# EAGLE board RX08-8-9 (EAGLE 6.6.0), part 1 of 2
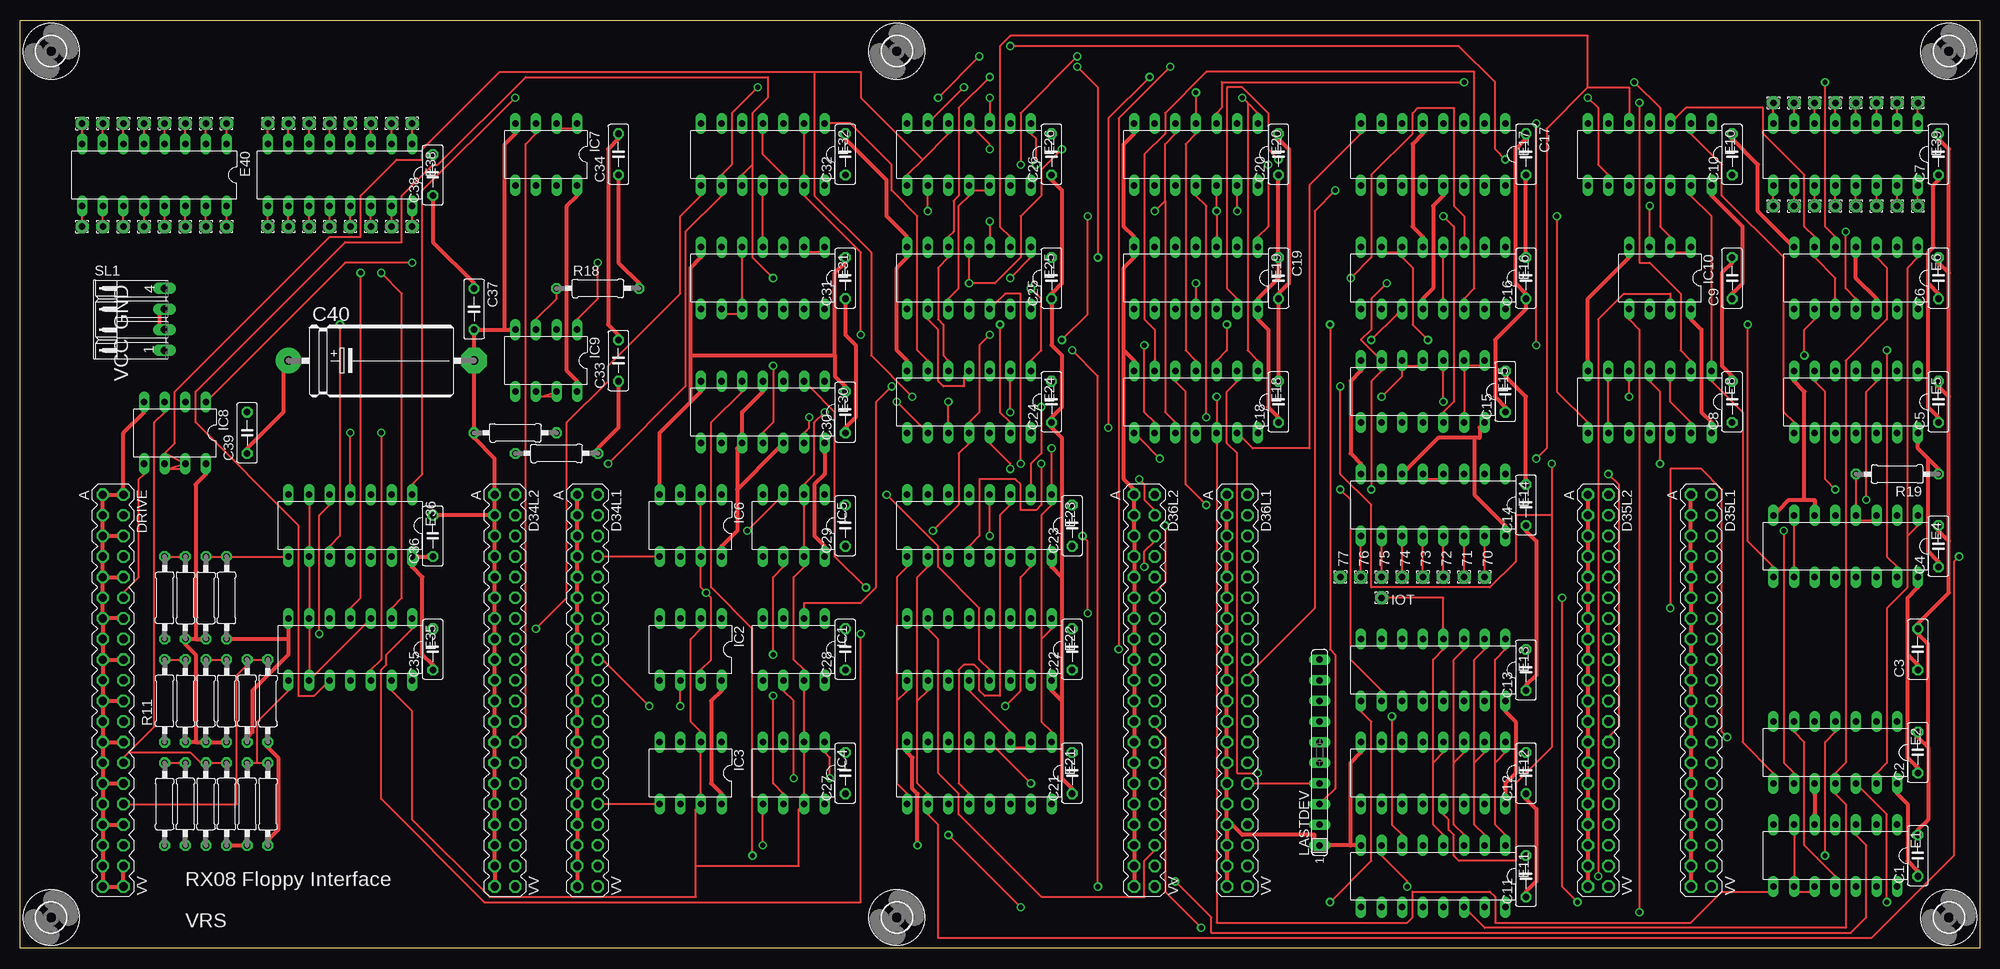
[diagram p3: board, top side]
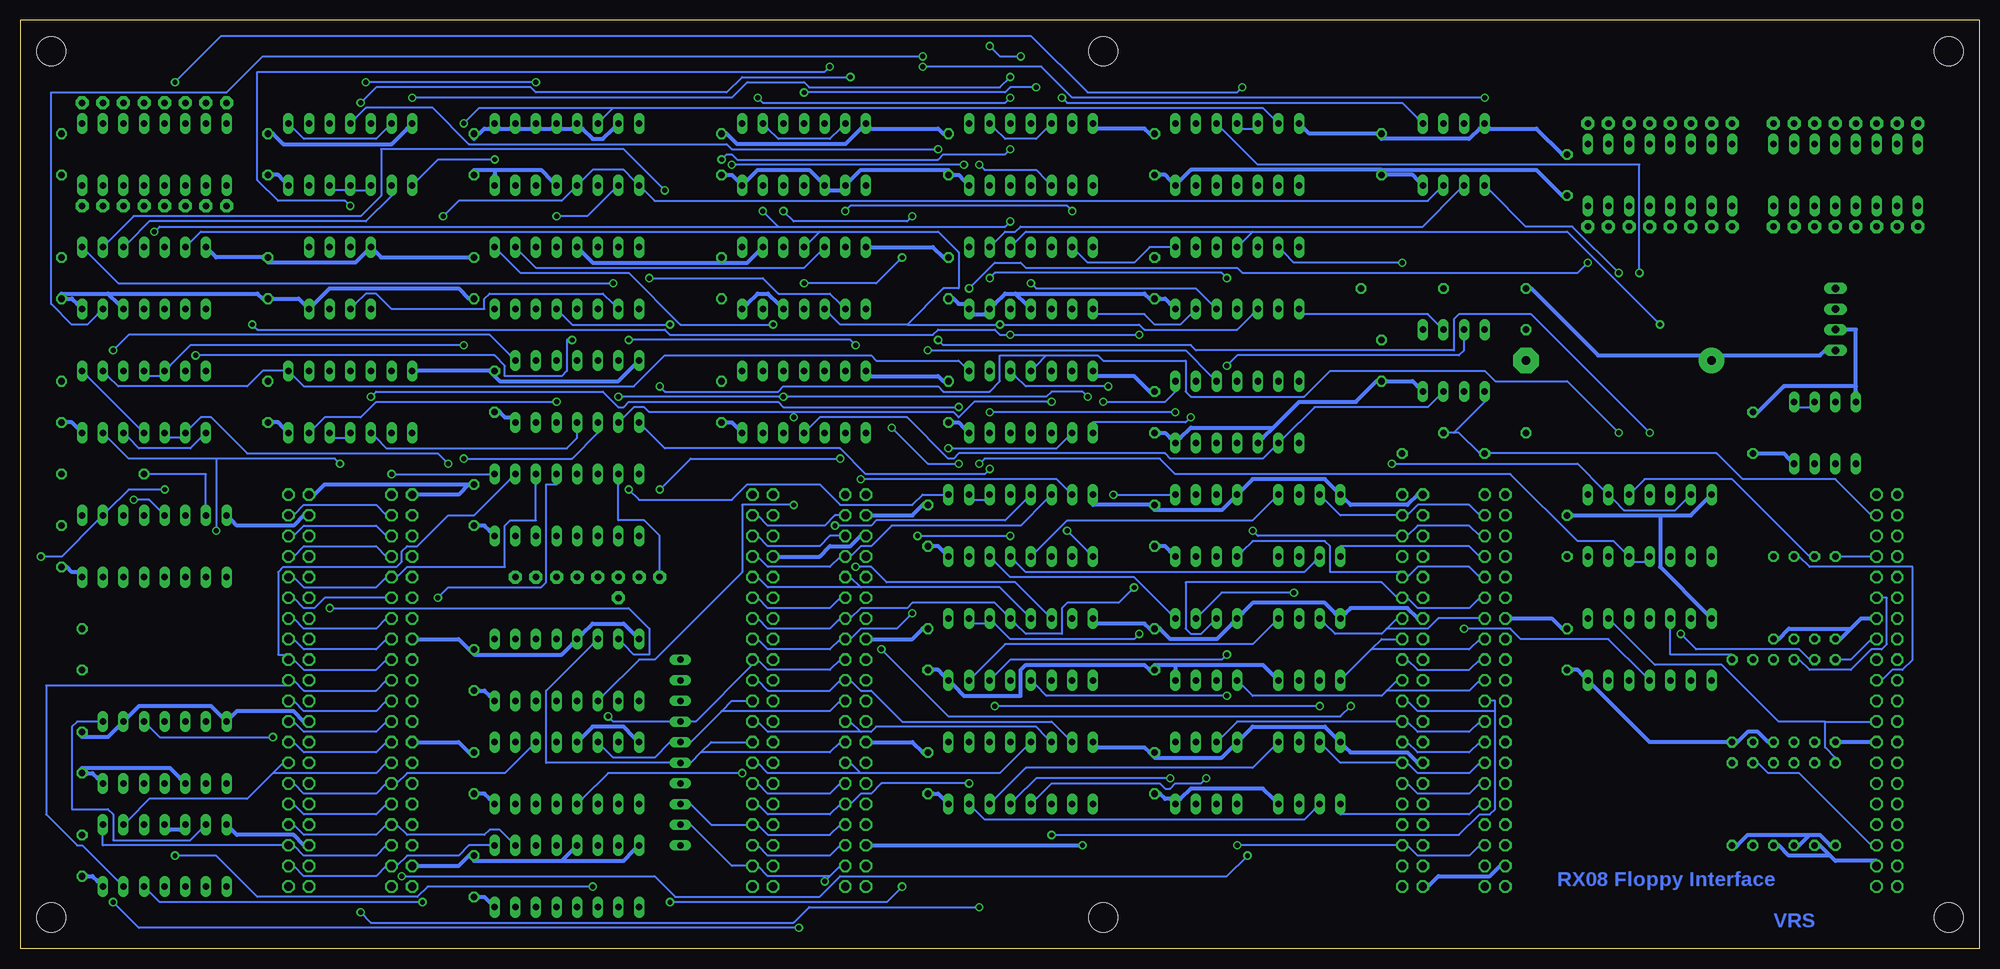
[diagram p4: board, bottom side, seen from below]

Size 241.3 x 114.3 mm. Coordinates in mm from the lower left corner, seen from the top.
Outline: 0,0 0,114.3 241.3,114.3 241.3,0 0,0
Copper layers (1*16): Top 0.035mm / dielectric 1.5mm / Bottom 0.035mm
Design rules "olimex10mil": minimum track width 10mil, minimum drill 24mil, track to track 10mil, track to pad 10mil, pad to pad 10mil, via to via 10mil, smd to smd 10mil, copper to edge 25mil, drill to drill 10mil, minimum pad ring 10mil, minimum via ring 8mil, stop-mask expansion 0mil, vias tented up to drill 0mil, thermal gap 10mil
Net classes: 1 supply: width 0.508 mm

## Footprints (pad centres in the part's own frame; a part is rotated, then mirrored left to right if it is on the bottom)
1,6/0,8 = drill 0.813 pad 1.6 octagon: 1 0,0
C050-025X075 = drill 0.813 octagon: 1 -2.54,0; 2 2.54,0
E22-9 = drill 1.016 pad 3.15: + -11.43,0 | drill 1.016 pad 3.15 octagon: - 11.43,0
DEC40PINV = drill 1.016 octagon: A -24.13,-1.27; AA 3.81,-1.27; B -24.13,1.27; BB 3.81,1.27; C -21.59,-1.27; CC 6.35,-1.27; D -21.59,1.27; DD 6.35,1.27; E -19.05,-1.27; EE 8.89,-1.27; F -19.05,1.27; FF 8.89,1.27; H -16.51,-1.27; HH 11.43,-1.27; J -16.51,1.27; JJ 11.43,1.27; K -13.97,-1.27; KK 13.97,-1.27; L -13.97,1.27; LL 13.97,1.27; M -11.43,-1.27; MM 16.51,-1.27; N -11.43,1.27; NN 16.51,1.27; P -8.89,-1.27; PP 19.05,-1.27; R -8.89,1.27; RR 19.05,1.27; S -6.35,-1.27; SS 21.59,-1.27; T -6.35,1.27; TT 21.59,1.27; U -3.81,-1.27; UU 24.13,-1.27; V -3.81,1.27; VV 24.13,1.27; W -1.27,-1.27; X -1.27,1.27; Y 1.27,-1.27; Z 1.27,1.27
DIL14 = drill 0.813 long: 1 -7.62,-3.81; 2 -5.08,-3.81; 3 -2.54,-3.81; 4 0,-3.81; 5 2.54,-3.81; 6 5.08,-3.81; 7 7.62,-3.81; 8 7.62,3.81; 9 5.08,3.81; 10 2.54,3.81; 11 0,3.81; 12 -2.54,3.81; 13 -5.08,3.81; 14 -7.62,3.81
DIL16 = drill 0.813 long: 1 -8.89,-3.81; 2 -6.35,-3.81; 3 -3.81,-3.81; 4 -1.27,-3.81; 5 1.27,-3.81; 6 3.81,-3.81; 7 6.35,-3.81; 8 8.89,-3.81; 9 8.89,3.81; 10 6.35,3.81; 11 3.81,3.81; 12 1.27,3.81; 13 -1.27,3.81; 14 -3.81,3.81; 15 -6.35,3.81; 16 -8.89,3.81
DIL08 = drill 0.813 long: 1 -3.81,-3.81; 2 -1.27,-3.81; 3 1.27,-3.81; 4 3.81,-3.81; 5 3.81,3.81; 6 1.27,3.81; 7 -1.27,3.81; 8 -3.81,3.81
SIL10 = drill 0.813 long: 1 -11.43,0; 2 -8.89,0; 3 -6.35,0; 4 -3.81,0; 5 -1.27,0; 6 1.27,0; 7 3.81,0; 8 6.35,0; 9 8.89,0; 10 11.43,0
0207/10 = drill 0.813 octagon: 1 -5.08,0; 2 5.08,0
04PA = drill 0.914 long: 1 -3.81,0; 2 -1.27,0; 3 1.27,0; 4 3.81,0
3,6 = hole 3.6: 0,0

## Placement (x,y rotation side)
70  [1,6/0,8]  180.34,45.72 270 top
71  [1,6/0,8]  177.8,45.72 270 top
72  [1,6/0,8]  175.26,45.72 270 top
73  [1,6/0,8]  172.72,45.72 270 top
74  [1,6/0,8]  170.18,45.72 270 top
75  [1,6/0,8]  167.64,45.72 270 top
76  [1,6/0,8]  165.1,45.72 270 top
77  [1,6/0,8]  162.56,45.72 270 top
C1  0.1  [C050-025X075]  233.68,11.43 90 top
C2  0.1  [C050-025X075]  233.68,24.13 90 top
C3  0.1  [C050-025X075]  233.68,36.83 90 top
C4  0.1  [C050-025X075]  236.22,49.53 90 top
C5  0.1  [C050-025X075]  236.22,67.31 90 top
C6  0.1  [C050-025X075]  236.22,82.55 90 top
C7  0.1  [C050-025X075]  236.22,97.79 90 top
C8  0.1  [C050-025X075]  210.82,67.31 90 top
C9  0.1  [C050-025X075]  210.82,82.55 90 top
C10  0.1  [C050-025X075]  210.82,97.79 90 top
C11  0.1  [C050-025X075]  185.42,8.89 90 top
C12  0.1  [C050-025X075]  185.42,21.59 90 top
C13  0.1  [C050-025X075]  185.42,34.29 90 top
C14  0.1  [C050-025X075]  185.42,54.61 90 top
C15  0.1  [C050-025X075]  182.88,68.58 90 top
C16  0.1  [C050-025X075]  185.42,82.55 90 top
C17  0.1  [C050-025X075]  185.42,97.79 270 top
C18  0.1  [C050-025X075]  154.94,67.31 90 top
C19  0.1  [C050-025X075]  154.94,82.55 270 top
C20  0.1  [C050-025X075]  154.94,97.79 90 top
C21  0.1  [C050-025X075]  129.54,21.59 90 top
C22  0.1  [C050-025X075]  129.54,36.83 90 top
C23  0.1  [C050-025X075]  129.54,52.07 90 top
C24  0.1  [C050-025X075]  127,67.31 90 top
C25  0.1  [C050-025X075]  127,82.55 90 top
C26  0.1  [C050-025X075]  127,97.79 90 top
C27  0.1  [C050-025X075]  101.6,21.59 90 top
C28  0.1  [C050-025X075]  101.6,36.83 90 top
C29  0.1  [C050-025X075]  101.6,52.07 90 top
C30  0.1  [C050-025X075]  101.6,66.04 90 top
C31  0.1  [C050-025X075]  101.6,82.55 90 top
C32  0.1  [C050-025X075]  101.6,97.79 90 top
C33  0.1  [C050-025X075]  73.66,72.39 90 top
C34  0.1  [C050-025X075]  73.66,97.79 90 top
C35  0.1  [C050-025X075]  50.8,36.83 90 top
C36  0.1  [C050-025X075]  50.8,50.8 90 top
C37  0.1  [C050-025X075]  55.88,78.74 270 top
C38  0.1  [C050-025X075]  50.8,95.25 90 top
C39  0.1  [C050-025X075]  27.94,63.5 90 top
C40  100uf  [E22-9]  44.45,72.39 0 top
D34L1  [DEC40PINV]  69.85,31.75 270 top
D34L2  [DEC40PINV]  59.69,31.75 270 top
D35L1  [DEC40PINV]  207.01,31.75 270 top
D35L2  [DEC40PINV]  194.31,31.75 270 top
D36L1  [DEC40PINV]  149.86,31.75 270 top
D36L2  [DEC40PINV]  138.43,31.75 270 top
DRIVE  [DEC40PINV]  11.43,31.75 270 top
E1  74LS10N  [DIL14]  223.52,11.43 180 top
E2  74LS74N  [DIL14]  223.52,24.13 180 top
E4  74LS161N  [DIL16]  224.79,49.53 180 top
E5  74LS00N  [DIL14]  226.06,67.31 180 top
E6  74LS74N  [DIL14]  226.06,82.55 180 top
E8  74LS10N  [DIL14]  200.66,67.31 180 top
E10  74LS10N  [DIL14]  200.66,97.79 180 top
E11  74LS138N  [DIL16]  173.99,8.89 180 top
E12  74LS138N  [DIL16]  173.99,21.59 180 top
E13  74LS138N  [DIL16]  173.99,34.29 180 top
E14  74LS138N  [DIL16]  173.99,54.61 180 top
E15  74LS00N  [DIL14]  172.72,68.58 180 top
E16  74LS75N  [DIL16]  173.99,82.55 180 top
E17  7476N  [DIL16]  173.99,97.79 180 top
E18  74LS02N  [DIL14]  144.78,67.31 180 top
E19  74LS74N  [DIL14]  144.78,82.55 180 top
E20  74LS32N  [DIL14]  144.78,97.79 180 top
E21  74LS195N  [DIL16]  118.11,21.59 180 top
E22  74LS195N  [DIL16]  118.11,36.83 180 top
E23  74LS195N  [DIL16]  118.11,52.07 180 top
E24  74LS08N  [DIL14]  116.84,67.31 180 top
E25  74LS04N  [DIL14]  116.84,82.55 180 top
E26  74LS02N  [DIL14]  116.84,97.79 180 top
E30  74LS74N  [DIL14]  91.44,66.04 180 top
E31  74LS20N  [DIL14]  91.44,82.55 180 top
E32  74LS27N  [DIL14]  91.44,97.79 180 top
E35  74LS02N  [DIL14]  40.64,36.83 180 top
E36  74LS02N  [DIL14]  40.64,52.07 180 top
E38  SPARE  [DIL16]  39.37,95.25 180 top
E39  SPARE  [DIL16]  224.79,97.79 180 top
E40  SPARE  [DIL16]  16.51,95.25 180 top
IC1  DS75452N  [DIL08]  95.25,36.83 180 top
IC2  DS75452N  [DIL08]  82.55,36.83 180 top
IC3  DS75452N  [DIL08]  82.55,21.59 180 top
IC4  DS75452N  [DIL08]  95.25,21.59 180 top
IC5  DS75452N  [DIL08]  95.25,52.07 180 top
IC6  DS75452N  [DIL08]  82.55,52.07 180 top
IC7  DS75452N  [DIL08]  64.77,97.79 180 top
IC8  DS75452N  [DIL08]  19.05,63.5 180 top
IC9  DS75452N  [DIL08]  64.77,72.39 180 top
IC10  DS75452N  [DIL08]  201.93,82.55 180 top
IOT  [1,6/0,8]  167.64,43.18 270 top
LASTDEV  100  [SIL10]  160.02,24.13 90 top
PAD10  [1,6/0,8]  48.26,101.6 0 top
PAD11  [1,6/0,8]  45.72,101.6 0 top
PAD12  [1,6/0,8]  43.18,101.6 0 top
PAD13  [1,6/0,8]  40.64,101.6 0 top
PAD14  [1,6/0,8]  38.1,101.6 0 top
PAD15  [1,6/0,8]  35.56,101.6 0 top
PAD16  [1,6/0,8]  33.02,101.6 0 top
PAD17  [1,6/0,8]  30.48,101.6 0 top
PAD18  [1,6/0,8]  25.4,101.6 180 top
PAD19  [1,6/0,8]  22.86,101.6 180 top
PAD20  [1,6/0,8]  48.26,88.9 0 top
PAD21  [1,6/0,8]  45.72,88.9 0 top
PAD22  [1,6/0,8]  43.18,88.9 0 top
PAD23  [1,6/0,8]  40.64,88.9 0 top
PAD24  [1,6/0,8]  38.1,88.9 0 top
PAD25  [1,6/0,8]  35.56,88.9 0 top
PAD26  [1,6/0,8]  33.02,88.9 0 top
PAD27  [1,6/0,8]  30.48,88.9 0 top
PAD28  [1,6/0,8]  20.32,101.6 180 top
PAD29  [1,6/0,8]  17.78,101.6 180 top
PAD30  [1,6/0,8]  15.24,101.6 180 top
PAD31  [1,6/0,8]  12.7,101.6 180 top
PAD32  [1,6/0,8]  10.16,101.6 180 top
PAD33  [1,6/0,8]  7.62,101.6 180 top
PAD34  [1,6/0,8]  25.4,88.9 180 top
PAD35  [1,6/0,8]  22.86,88.9 180 top
PAD36  [1,6/0,8]  20.32,88.9 180 top
PAD37  [1,6/0,8]  17.78,88.9 180 top
PAD38  [1,6/0,8]  15.24,88.9 180 top
PAD39  [1,6/0,8]  12.7,88.9 180 top
PAD40  [1,6/0,8]  10.16,88.9 180 top
PAD41  [1,6/0,8]  7.62,88.9 180 top
PAD42  [1,6/0,8]  233.68,104.14 180 top
PAD43  [1,6/0,8]  231.14,104.14 180 top
PAD44  [1,6/0,8]  228.6,104.14 180 top
PAD45  [1,6/0,8]  226.06,104.14 180 top
PAD46  [1,6/0,8]  223.52,104.14 180 top
PAD47  [1,6/0,8]  220.98,104.14 180 top
PAD48  [1,6/0,8]  218.44,104.14 180 top
PAD49  [1,6/0,8]  215.9,104.14 180 top
PAD50  [1,6/0,8]  233.68,91.44 180 top
PAD51  [1,6/0,8]  231.14,91.44 180 top
PAD52  [1,6/0,8]  228.6,91.44 180 top
PAD53  [1,6/0,8]  226.06,91.44 180 top
PAD54  [1,6/0,8]  223.52,91.44 180 top
PAD55  [1,6/0,8]  220.98,91.44 180 top
PAD56  [1,6/0,8]  218.44,91.44 180 top
PAD57  [1,6/0,8]  215.9,91.44 180 top
R1  180  [0207/10]  20.32,30.48 270 top
R2  180  [0207/10]  30.48,30.48 270 top
R3  180  [0207/10]  30.48,17.78 270 top
R4  180  [0207/10]  22.86,43.18 270 top
R5  180  [0207/10]  20.32,43.18 270 top
R6  180  [0207/10]  66.04,60.96 0 top
R7  180  [0207/10]  22.86,17.78 270 top
R8  180  [0207/10]  17.78,17.78 270 top
R9  390  [0207/10]  22.86,30.48 270 top
R10  390  [0207/10]  27.94,30.48 90 top
R11  390  [0207/10]  17.78,30.48 90 top
R12  390  [0207/10]  27.94,17.78 90 top
R13  390  [0207/10]  25.4,43.18 90 top
R14  390  [0207/10]  17.78,43.18 90 top
R15  390  [0207/10]  60.96,63.5 0 top
R16  390  [0207/10]  25.4,17.78 90 top
R17  390  [0207/10]  20.32,17.78 90 top
R18  10K  [0207/10]  71.12,81.28 0 top
R19  10K  [0207/10]  231.14,58.42 180 top
R20  180  [0207/10]  25.4,30.48 270 top
SL1  [04PA]  17.78,77.47 90 top
U$1  [3,6]  237.49,3.81 0 top
U$2  [3,6]  237.49,110.49 0 top
U$3  [3,6]  3.81,110.49 0 top
U$4  [3,6]  3.81,3.81 0 top
U$5  [3,6]  107.95,110.49 0 top
U$6  [3,6]  107.95,3.81 0 top

## Tracks (layer width: path | path; a pad name or v marks a point on that pad's centre or on a via)
8/12  (via drill 0.61)
  Top 0.254: v201.93,59.69 201.93,68.58 200.66,69.85 E8.4 | v217.17,51.44 217.17,22.86 218.44,21.59 E2.9
  Bottom 0.254: v201.93,59.69 202.56,60.33 217.17,60.33 | 217.17,60.33 227.97,60.33 230.5,62.87 E5.13 | 217.17,60.33 v217.17,51.44
8/!12  (via drill 0.61)
  Top 0.254: E2.8 215.9,21.59 212.09,25.4 212.09,66.04 208.28,69.85 E8.1 208.28,72.39 208.28,90.17 205.74,92.71 E10.13 | v48.26,84.45 40.01,84.45 23.5,67.94 IC8.1 | v124.46,81.28 125.73,80.01 125.73,73.66 124.46,72.39 E24.1
  Bottom 0.254: IC8.2 20.95,66.67 22.23,66.67 IC8.1 | E24.1 125.09,71.75 125.73,72.39 135.89,72.39 136.53,73.03 161.93,73.03 165.74,69.22 206.38,69.22 207.65,70.48 E8.1 208.91,71.12 211.46,71.12 213.36,69.22 229.24,69.22 230.5,70.48 E5.2 | v48.26,84.45 49.53,83.19 90.81,83.19 91.44,83.82 117.47,83.82 118.11,84.45 121.28,84.45 v124.46,81.28
!ACB00
  Bottom 0.254: IC6.3 80.64,55.24 78.74,53.34 71.75,53.34 D34L1.D 70.48,53.34 69.22,54.61 62.87,54.61 61.59,53.34 D34L2.D
!ACB01
  Top 0.254: IC6.5 78.11,48.26 71.75,48.26 D34L1.J
  Bottom 0.254: D34L2.J 61.59,48.26 62.87,49.53 78.74,49.53 IC6.5
!ACB02
  Bottom 0.254: IC1.3 94.61,40.01 95.89,38.73 97.16,38.73 97.79,39.37 97.79,45.09 73.66,45.09 71.75,43.18 D34L1.N 70.48,43.18 69.22,41.91 62.87,41.91 61.59,43.18 D34L2.N
!ACB03
  Bottom 0.254: 74.93,36.83 73.66,38.1 71.75,38.1 D34L1.T | 74.93,36.83 78.11,33.66 IC2.5 | 74.93,36.83 62.87,36.83 61.59,38.1 D34L2.T
!ACB04
  Bottom 0.254: 73.03,31.75 71.75,33.02 D34L1.X | 73.03,31.75 73.66,31.11 89.53,31.11 90.81,32.38 IC1.5 | 73.03,31.75 62.87,31.75 61.59,33.02 D34L2.X
!ACB05
  Bottom 0.254: IC4.3 93.34,26.04 91.44,27.94 71.75,27.94 D34L1.BB 70.48,27.94 69.22,26.67 62.87,26.67 61.59,27.94 D34L2.BB
!ACB06
  Bottom 0.254: IC3.3 80.64,24.77 78.74,22.86 71.75,22.86 D34L1.FF 70.48,22.86 69.22,21.59 62.87,21.59 61.59,22.86 D34L2.FF
!ACB07
  Top 0.254: IC3.5 78.11,17.78 71.75,17.78 D34L1.LL
  Bottom 0.254: D34L2.LL 61.59,17.78 62.87,16.51 78.74,16.51 IC3.5
!ACB08  (via drill 0.61)
  Top 0.254: v91.44,12.7 91.44,16.51 IC4.5
  Bottom 0.254: v91.44,12.7 71.75,12.7 D34L1.RR 70.48,12.7 69.22,11.43 62.87,11.43 61.59,12.7 D34L2.RR
!ACB09  (via drill 0.61)
  Top 0.254: v89.53,51.44 93.34,55.24 IC5.3
  Bottom 0.254: v89.53,51.44 88.9,50.8 71.75,50.8 D34L1.F 70.48,50.8 69.22,52.07 62.87,52.07 61.59,50.8 D34L2.F
!ACB10
  Bottom 0.254: IC5.5 90.81,48.9 89.53,50.16 80.64,50.16 80.01,49.53 80.01,46.35 71.12,46.35 D34L1.L 70.48,45.72 69.22,46.99 62.87,46.99 61.59,45.72 D34L2.L
!ACB11
  Bottom 0.254: 73.03,39.37 71.75,40.64 D34L1.R | 73.03,39.37 73.66,38.73 79.38,38.73 80.64,40.01 IC2.3 | 73.03,39.37 67.94,39.37 66.67,40.64 61.59,40.64 D34L2.R
!ACCLEAR
  Top 0.254: IC7.3 63.5,100.33 62.23,99.06 62.23,27.3 60.96,26.04 D34L2.DD
  Bottom 0.254: D34L1.DD 70.48,25.4 69.22,24.13 62.87,24.13 61.59,25.4 D34L2.DD
!BMB03
  Bottom 0.254: D35L2.T 196.22,38.1 197.49,36.83 206.38,36.83 207.65,38.1 D35L1.T
!BMB04
  Bottom 0.254: D35L2.BB 196.22,27.94 197.49,26.67 206.38,26.67 207.65,27.94 D35L1.BB
!BMB05
  Bottom 0.254: D35L2.LL 196.22,17.78 197.49,16.51 206.38,16.51 207.65,17.78 D35L1.LL
!BMB06
  Bottom 0.254: D35L2.F 196.22,50.8 197.49,52.07 206.38,52.07 207.65,50.8 D35L1.F
!BMB07
  Bottom 0.254: D35L2.R 196.22,40.64 197.49,39.37 206.38,39.37 207.65,40.64 D35L1.R
!BMB08
  Bottom 0.254: D35L2.Z 196.22,30.48 197.49,29.21 206.38,29.21 207.65,30.48 D35L1.Z
!BRUN
  Bottom 0.254: D34L2.JJ 61.59,20.32 62.87,19.05 69.22,19.05 70.48,20.32 D34L1.JJ
!CLK_PARITY  (via drill 0.61)
  Top 0.254: v186.69,74.3 v186.69,101.6
  Bottom 0.254: E5.4 225.43,70.48 224.16,70.48 E5.5 222.88,71.75 220.34,74.3 v186.69,74.3 | 168.28,103.5 88.27,103.5 87,102.23 E32.6 | 168.28,103.5 169.54,102.23 E17.6 | v186.69,101.6 184.78,103.5 168.28,103.5
!DONE  (via drill 0.61)
  Top 0.254: E25.4 116.84,85.09 v116.84,81.92 120.02,81.92 123.19,85.09 123.19,90.17 125.73,92.71 125.73,95.89 v128.27,98.42
  Bottom 0.254: v116.84,81.92 116.2,81.28 96.52,81.28 94.61,79.38 E31.12 | v128.27,98.42 153.67,98.42 154.31,99.06 186.06,99.06 190.5,103.5 198.75,103.5 200.03,102.23 E10.4
!ENB_BUF_LD  (via drill 0.61)
  Top 0.254: 107.95,30.48 107.95,20.32 109.22,19.05 E21.9 | 107.95,30.48 109.22,31.75 E22.9 | 107.95,30.48 107.95,45.72 109.22,46.99 E23.9 | E32.2 96.52,100.33 96.52,95.25 E32.13 96.52,92.71 103.5,85.72 v103.5,75.56 | v212.72,76.83 212.72,50.16 215.9,46.99 E4.9 | v119.38,75.56 118.11,74.3 118.11,66.04 116.84,64.77 E24.11 116.84,62.23 115.57,60.96 115.57,54.61 v112.39,51.44
  Bottom 0.254: v212.72,76.83 212.09,76.2 161.93,76.2 161.29,75.56 128.91,75.56 128.27,76.2 121.28,76.2 120.65,75.56 v119.38,75.56 v103.5,75.56 | v112.39,51.44 109.86,48.9 E23.9
!INIT  (via drill 0.61)
  Top 0.254: 232.41,50.8 232.41,44.45 229.87,41.91 229.87,22.86 228.6,21.59 E2.13 | 232.41,50.8 233.68,52.07 E4.1 | 232.41,50.8 232.41,83.82 233.68,85.09 E6.1 | 125.73,38.1 125.73,27.94 127,26.67 E21.1 | 125.73,38.1 127,39.37 E22.1 | 125.73,38.1 125.73,53.34 127,54.61 E23.1 127,57.15 v127,61.59 | v107.95,67.31 111.12,64.14 E24.9 | v166.37,56.52 166.37,69.85 167.64,71.12 E15.6 167,73.03 165.1,74.93 166.37,76.2 166.37,80.01 v168.28,81.92
  Bottom 0.254: v127,61.59 113.67,61.59 112.39,62.87 E24.9 | v107.95,67.31 100.33,67.31 99.06,68.58 E30.1 | v166.37,56.52 165.1,55.24 153.67,55.24 151.76,57.15 142.88,57.15 140.34,54.61 131.44,54.61 130.18,55.88 127.64,55.88 E23.1 | v168.28,81.92 229.24,81.92 233.04,85.72 E6.1
!INIT1  (via drill 0.61)
  Top 0.254: v170.81,7.62 170.81,8.26 167.64,11.43 E11.7 | v222.25,11.43 222.25,25.4 223.52,26.67 E2.4
  Bottom 0.254: v170.81,7.62 191.13,7.62 192.41,6.35 212.09,6.35 217.17,11.43 v222.25,11.43
!INIT4  (via drill 0.61)
  Top 0.254: v210.19,26.04 209.55,26.67 209.55,56.52 207.01,59.05 203.2,59.05 v203.2,41.91
  Bottom 0.254: v210.19,26.04 224.16,26.04 225.43,27.3 E2.3 | v203.2,41.91 166.37,41.91 163.83,39.37 163.83,36.2 165.74,36.2 167,37.47 E13.7
!INT_RQ  (via drill 0.61)
  Top 0.254: v199.39,4.45 199.39,76.2 198.12,77.47 IC10.5 | v123.19,5.08 v114.3,13.97
  Bottom 0.254: v199.39,4.45 198.12,3.17 146.05,3.17 144.15,5.08 v123.19,5.08 | v114.3,13.97 64.14,13.97 61.59,16.51 60.33,16.51 59.69,17.14 59.69,29.21 | 59.69,29.21 59.69,30.48 60.33,30.48 D34L2.Z | 59.69,29.21 69.22,29.21 70.48,30.48 D34L1.Z
!INTR4  (via drill 0.61)
  Top 0.254: v129.54,73.66 132.72,70.48 v132.72,7.62 | v161.29,5.71 166.37,10.79 166.37,27.94 165.1,29.21 E13.9
  Bottom 0.254: v129.54,73.66 97.79,73.66 94.61,70.48 E30.3 | v132.72,7.62 134.62,5.71 v161.29,5.71
!IOS  (via drill 0.61)
  Top 0.254: v200.66,91.44 200.66,87.63 IC10.3 | v141.6,108.58 135.25,102.23 v135.25,36.83 | v77.47,29.84 71.75,35.56 D34L1.V
  Bottom 0.254: v200.66,91.44 201.29,92.08 209.55,92.08 212.09,94.61 212.09,107.95 142.24,107.95 v141.6,108.58 | v135.25,36.83 127,28.57 78.74,28.57 v77.47,29.84 | D34L2.V 61.59,35.56 62.87,34.29 69.22,34.29 70.48,35.56 D34L1.V
!LCD1  (via drill 0.61)
  Top 0.254: E11.14 178.44,4.45 180.34,2.54 224.79,2.54 224.79,17.78 223.52,19.05 E2.11 223.52,21.59 224.79,22.86 224.79,72.39 229.87,77.47 229.87,83.82 228.6,85.09 E6.3 | E24.5 114.3,72.39 113.67,73.03 113.67,76.83 113.03,77.47 113.03,83.82 114.3,85.09 E25.5 114.3,87.63 114.94,88.27 114.94,92.08 115.57,92.71 115.57,103.5 v119.38,107.31 | v193.04,104.78 194.31,103.5 194.31,96.52 195.58,95.25 E10.9
  Bottom 0.254: E10.9 195.58,92.71 198.75,89.53 225.43,89.53 227.97,87 E6.3 | v119.38,107.31 120.65,106.05 144.15,106.05 144.78,106.68 151.76,106.68 153.67,104.78 v193.04,104.78
!MAINT  (via drill 0.61)
  Top 0.254: E6.10 223.52,80.01 223.52,82.55 220.98,85.09 E6.6 220.98,87.63 219.71,88.9 219.71,95.25 214.63,100.33 214.63,103.5 205.1,103.5 203.84,102.23 E10.3 | E31.9 87,78.11 88.27,78.11 E31.10 88.9,80.01 88.9,85.09 E31.5 | v120.65,76.83 120.65,66.04 121.92,64.77 E24.13
  Bottom 0.254: 132.08,76.83 140.34,76.83 141.6,78.11 E19.10 | 132.08,76.83 v120.65,76.83 103.5,76.83 102.87,76.2 91.44,76.2 89.53,78.11 E31.10 | 142.88,88.27 144.15,87 E19.4 | 142.88,88.27 128.27,88.27 125.73,85.72 125.73,81.28 127.64,81.28 132.08,76.83 | 142.88,88.27 219.07,88.27 220.34,87 E6.6
!MYDEV
  Top 0.254: 173.99,22.86 173.99,15.24 175.26,13.97 E11.4 | 173.99,22.86 175.26,24.13 E12.4 | 173.99,22.86 173.99,35.56 175.26,36.83 E13.4 175.26,39.37 175.26,43.18 168.28,43.18 IOT.1
!PARITY  (via drill 0.61)
  Top 0.254: v175.26,90.17 176.53,88.9 176.53,67.31 175.26,66.04 E15.12
  Bottom 0.254: v175.26,90.17 171.45,90.17 168.28,93.34 E17.10
!RX_12_BIT
  Top 0.254: R16.2 24.77,22.86 23.5,22.86 R7.1 22.23,22.86 20.95,24.13 13.34,24.13 | 13.34,24.13 12.7,23.5 DRIVE.FF | 13.34,24.13 16.51,27.3 16.51,64.77 17.78,66.04 IC8.3
!RX_DATA  (via drill 0.61)
  Top 0.254: R8.1 18.41,22.86 19.68,22.86 R17.2 | v44.45,83.19 46.99,80.64 46.99,43.18 45.72,41.91 E35.2
  Bottom 0.254: 19.05,27.94 13.34,27.94 DRIVE.BB | 19.05,27.94 24.77,27.94 31.75,34.92 40.01,34.92 45.09,40.01 E35.2 | v44.45,83.19 50.16,88.9 55.88,88.9 60.33,93.34 IC7.5 | 19.05,27.94 19.05,24.77 17.78,23.5 R8.1
!RX_DONE
  Top 0.254: R4.1 23.5,48.26 24.77,48.26 R13.2 26.04,48.26 32.38,48.26 E36.8
  Bottom 0.254: DRIVE.X 12.06,33.02 10.79,34.29 9.53,34.29 8.26,35.56 8.26,46.99 20.95,46.99 22.23,48.26 R4.1
!RX_ERROR
  Top 0.254: R14.2 18.41,48.26 19.68,48.26 R5.1
  Bottom 0.254: E36.3 42.55,56.52 41.27,57.78 30.48,57.78 20.95,48.26 R5.1 | DRIVE.J 13.34,48.26 17.14,48.26 R14.2
!RX_INIT
  Top 0.254: R9.1 23.5,35.56 24.77,35.56 R20.1 | IC8.5 15.24,58.42 14.61,57.78 14.61,45.72 12.7,43.81 DRIVE.N
  Bottom 0.254: R9.1 22.23,35.56 20.95,34.29 15.88,34.29 13.34,36.83 12.06,36.83 11.43,37.47 11.43,43.18 12.06,43.18 DRIVE.N
!RX_OUT
  Top 0.254: 29.21,22.86 29.84,22.86 R3.1 | 29.21,22.86 28.57,22.86 R12.2 | 29.21,22.86 29.21,27.94 33.02,31.75 E35.8
  Bottom 0.254: DRIVE.RR 13.34,12.7 22.23,21.59 26.04,21.59 27.3,22.86 R12.2
!RX_RUN
  Bottom 0.254: 64.77,63.5 65.41,63.5 R15.2 | 64.77,63.5 64.14,63.5 61.59,60.96 R6.1 60.33,60.96 32.38,60.96 29.21,57.78 17.78,57.78 13.34,53.34 DRIVE.D | 64.77,63.5 60.96,67.31 IC9.5
!RX_SHIFT
  Top 0.254: R2.1 29.84,35.56 28.57,35.56 R10.2 27.94,34.92 26.67,33.66 26.67,17.78 13.34,17.78 DRIVE.LL
  Bottom 0.254: E35.5 38.1,39.37 38.1,36.2 30.48,36.2 R2.1
!RX_TR_REQ  (via drill 0.61)
  Top 0.254: R11.2 18.41,35.56 19.68,35.56 R1.1 | v36.83,38.73 36.83,53.34 38.1,54.61 E36.5
  Bottom 0.254: v36.83,38.73 34.92,36.83 22.23,36.83 20.95,35.56 R1.1 | DRIVE.T 13.34,38.1 15.88,35.56 17.14,35.56 R11.2
!SDN4  (via drill 0.61)
  Top 0.254: v162.56,56.52 163.83,55.24 163.83,35.56 167.64,31.75 E13.10 | v140.34,60.33 137.79,62.87 E18.8
  Bottom 0.254: v162.56,56.52 158.75,60.33 v140.34,60.33
!SER4  (via drill 0.61)
  Top 0.254: v146.05,54.61 143.51,57.15 143.51,68.58 142.24,69.85 E18.5
  Bottom 0.254: v146.05,54.61 152.4,54.61 152.4,46.35 163.19,35.56 165.1,35.56 169.54,31.11 E13.11
!STR2  (via drill 0.61)
  Top 0.254: v152.4,21.59 149.86,21.59 149.86,60.96 148.59,62.23 148.59,68.58 149.86,69.85 E18.2
  Bottom 0.254: v152.4,21.59 168.91,21.59 172.09,18.41 E12.12
!XDR2  (via drill 0.61)
  Top 0.254: v188.59,59.69 188.59,53.34 | 188.59,53.34 188.59,24.77 184.15,20.32 184.15,10.79 177.16,10.79 176.53,11.43 176.53,13.97 175.9,14.61 175.9,15.88 175.26,16.51 E12.13 | v44.45,63.5 44.45,35.56 43.18,34.29 E35.12 | E25.9 111.76,77.47 113.03,76.2 113.03,69.85 113.67,69.22 116.2,69.22 116.2,70.48 E24.4 | 188.59,53.34 184.15,53.34 184.15,47.62 180.97,44.45 166.37,44.45 166.37,54.61 162.56,58.42 v162.56,69.22
  Bottom 0.254: v188.59,59.69 189.87,60.96 213.36,60.96 217.81,65.41 219.07,65.41 220.34,64.14 E5.9 221.62,62.87 222.88,62.87 E5.10 | v44.45,63.5 50.8,69.85 59.69,69.85 60.96,71.12 80.01,71.12 83.19,67.94 97.16,67.94 97.79,68.58 97.79,72.39 107.95,72.39 108.58,73.03 114.94,73.03 | 114.94,73.03 116.2,71.75 E24.4 | v162.56,69.22 161.93,68.58 147.96,68.58 147.32,69.22 128.27,69.22 127.64,68.58 121.92,68.58 120.65,69.85 120.65,73.03 114.94,73.03
BAC00  (via drill 0.61)
  Top 0.254: v137.79,57.78 138.43,57.15 138.43,55.24 139.7,53.98 D36L2.D
  Bottom 0.254: v137.79,57.78 113.67,57.78 112.39,56.52 E23.7 | D36L1.D 150.5,53.34 149.22,52.07 142.24,52.07 140.97,53.34 140.34,53.34 D36L2.D
BAC01
  Bottom 0.254: E23.6 114.94,55.24 118.11,52.07 133.99,52.07 136.53,49.53 137.79,49.53 139.06,48.26 D36L2.J 140.34,48.26 141.6,46.99 149.22,46.99 150.5,48.26 D36L1.J
BAC02  (via drill 0.61)
  Top 0.254: v140.97,52.07 140.97,45.09 139.7,43.81 D36L2.N
  Bottom 0.254: v140.97,52.07 136.53,52.07 135.89,52.7 120.02,52.7 117.47,55.24 E23.5 | D36L1.N 150.5,43.18 149.22,41.91 141.6,41.91 140.34,43.18 D36L2.N
BAC03  (via drill 0.61)
  Top 0.254: v119.38,50.8 119.38,54.61 E23.4 | v130.81,50.8 131.44,50.16 v131.44,41.27
  Bottom 0.254: v130.81,50.8 v119.38,50.8 | v131.44,41.27 133.35,39.37 137.79,39.37 139.06,38.1 D36L2.T 140.34,38.1 141.6,36.83 149.22,36.83 150.5,38.1 D36L1.T
BAC04  (via drill 0.61)
  Top 0.254: v161.93,93.34 159.38,90.81 159.38,41.91 151.13,33.66 D36L1.X
  Bottom 0.254: E21.7 112.39,26.04 114.3,27.94 132.72,27.94 136.53,31.75 137.79,31.75 139.06,33.02 D36L2.X 140.34,33.02 141.6,31.75 149.22,31.75 150.5,33.02 D36L1.X | v161.93,93.34 167,98.42 196.85,98.42 196.85,92.71 199.39,90.17 227.33,90.17 230.5,87 E6.2
BAC05  (via drill 0.61)
  Top 0.254: v229.87,5.71 229.87,16.51 226.69,19.68 E2.12 | v145.41,2.54 140.97,6.99 140.97,26.04 139.7,27.3 D36L2.BB
  Bottom 0.254: 137.79,26.67 136.53,26.67 135.89,27.3 116.2,27.3 114.94,26.04 E21.6 | 137.79,26.67 139.06,27.94 D36L2.BB | v229.87,5.71 226.69,2.54 v145.41,2.54 | 137.79,26.67 149.22,26.67 150.5,27.94 D36L1.BB
BAC06
  Bottom 0.254: 137.79,21.59 120.65,21.59 117.47,24.77 E21.5 | 137.79,21.59 139.06,22.86 D36L2.FF | 137.79,21.59 149.22,21.59 150.5,22.86 D36L1.FF
BAC07  (via drill 0.61)
  Top 0.254: v124.46,20.32 120.02,24.77 E21.4
  Bottom 0.254: v124.46,20.32 135.25,20.32 136.53,19.05 137.79,19.05 139.06,17.78 D36L2.LL 140.34,17.78 141.6,16.51 149.22,16.51 150.5,17.78 D36L1.LL
BAC08
  Top 0.254: E22.7 111.76,39.37 113.03,38.1 113.03,21.59 115.57,19.05 115.57,16.51 125.73,6.35 138.43,6.35 138.43,10.79 139.7,12.06 D36L2.RR
  Bottom 0.254: D36L1.RR 150.5,12.7 149.22,11.43 141.6,11.43 140.34,12.7 D36L2.RR
BAC09  (via drill 0.61)
  Top 0.254: v138.43,46.99 138.43,48.9 139.7,50.16 D36L2.F
  Bottom 0.254: v138.43,46.99 136.53,46.99 134.62,45.09 118.75,45.09 114.94,41.27 E22.6 | D36L1.F 150.5,50.8 149.22,49.53 142.88,49.53 141.6,50.8 140.34,50.8 D36L2.F
BAC10
  Bottom 0.254: 137.79,44.45 120.65,44.45 117.47,41.27 E22.5 | 137.79,44.45 139.06,45.72 D36L2.L | 137.79,44.45 149.22,44.45 150.5,45.72 D36L1.L
BAC11  (via drill 0.61)
  Top 0.254: v104.14,44.45 100.33,48.26 100.33,66.04 97.16,69.22 E30.2
  Bottom 0.254: D36L1.R 150.5,40.64 149.22,39.37 141.6,39.37 140.34,40.64 D36L2.R 139.06,40.64 137.79,41.91 132.08,41.91 131.44,42.55 121.28,42.55 120.02,41.27 E22.4 118.75,40.01 117.47,38.73 113.03,38.73 113.03,41.91 112.39,42.55 106.05,42.55 v104.14,44.45
BINIT  (via drill 0.61)
  Top 0.254: v142.24,8.26 146.69,3.81 146.69,1.91 225.43,1.91 227.33,3.81 227.33,12.7 226.06,13.97 E1.3
  Bottom 0.254: LASTDEV.2 158.75,15.24 153.67,10.16 151.76,10.16 D36L1.TT 150.5,10.16 149.22,8.89 141.6,8.89 | 141.6,8.89 140.34,10.16 D36L2.TT | v142.24,8.26 141.6,8.89
BIOP1  (via drill 0.61)
  Top 0.254: v168.91,28.57 168.91,15.24 170.18,13.97 E11.6
  Bottom 0.254: D36L2.V 140.34,35.56 141.6,34.29 149.22,34.29 150.5,35.56 D36L1.V 151.13,34.92 158.12,27.94 158.75,27.94 LASTDEV.7 161.29,27.94 168.28,27.94 v168.91,28.57
BIOP2
  Bottom 0.254: 154.94,29.21 153.67,30.48 151.76,30.48 D36L1.Z | 154.94,29.21 158.75,25.4 LASTDEV.6 161.29,25.4 163.19,23.5 168.28,23.5 169.54,24.77 E12.6 | 154.94,29.21 141.6,29.21 140.34,30.48 D36L2.Z
BIOP4
  Bottom 0.254: 157.48,24.13 156.21,25.4 151.76,25.4 D36L1.DD | 157.48,24.13 158.75,22.86 LASTDEV.5 161.29,22.86 176.53,22.86 176.53,31.75 170.81,37.47 E13.6 | 157.48,24.13 141.6,24.13 140.34,25.4 D36L2.DD
BMB00
  Bottom 0.254: D35L2.D 196.22,53.34 197.49,54.61 206.38,54.61 207.65,53.34 D35L1.D
BMB01
  Bottom 0.254: D35L2.J 196.22,48.26 197.49,49.53 206.38,49.53 207.65,48.26 D35L1.J
BMB02
  Bottom 0.254: D35L2.N 196.22,43.18 203.84,43.18 205.1,41.91 206.38,41.91 207.65,43.18 D35L1.N
BMB03
  Bottom 0.254: E1.13 229.24,8.26 233.68,12.7 234.31,12.7 238.12,16.51 238.12,32.38 208.28,32.38 D35L1.X 207.65,33.02 206.38,31.75 197.49,31.75 196.22,33.02 D35L2.X
BMB04
  Bottom 0.254: 210.19,21.59 208.91,22.86 D35L1.FF | 210.19,21.59 213.36,18.41 225.43,18.41 227.97,15.88 E1.2 | 210.19,21.59 197.49,21.59 196.22,22.86 D35L2.FF
BMB05
  Bottom 0.254: E1.1 231.14,13.97 231.14,12.7 208.91,12.7 D35L1.RR 207.65,12.7 206.38,11.43 197.49,11.43 196.22,12.7 D35L2.RR
BMB06
  Bottom 0.254: E14.3 177.8,57.15 177.8,52.7 180.97,52.7 181.61,52.07 181.61,46.99 193.68,46.99 194.94,45.72 D35L2.L 196.22,45.72 197.49,44.45 206.38,44.45 207.65,45.72 D35L1.L
BMB07
  Bottom 0.254: E14.2 180.97,57.78 185.42,53.34 188.59,53.34 192.41,49.53 193.68,49.53 194.31,48.9 194.31,47.62 194.94,46.99 208.91,46.99 209.55,46.35 209.55,36.2 208.28,36.2 D35L1.V 207.65,35.56 206.38,34.29 197.49,34.29 196.22,35.56 D35L2.V
BMB08  (via drill 0.61)
  Top 0.254: v195.58,58.42 196.85,57.15 196.85,27.3 195.58,26.04 D35L2.DD
  Bottom 0.254: v195.58,58.42 183.51,58.42 E14.1 | D35L1.DD 207.65,25.4 206.38,24.13 197.49,24.13 196.22,25.4 D35L2.DD
BMB09
  Top 0.254: 176.53,22.86 176.53,15.24 177.8,13.97 E11.3 | 176.53,22.86 177.8,24.13 E12.3 | 176.53,22.86 176.53,35.56 177.8,36.83 E13.3
  Bottom 0.254: D35L1.JJ 207.65,20.32 206.38,19.05 197.49,19.05 196.22,20.32 D35L2.JJ 194.94,20.32 193.68,21.59 181.61,21.59 178.44,24.77 E12.3
BMB10
  Top 0.254: 179.07,22.86 179.07,15.24 180.34,13.97 E11.2 | 179.07,22.86 180.34,24.13 E12.2 | 179.07,22.86 179.07,35.56 180.34,36.83 E13.2
  Bottom 0.254: D35L1.NN 207.65,15.24 206.38,13.97 197.49,13.97 196.22,15.24 D35L2.NN 194.94,15.24 193.68,13.97 184.15,13.97 183.51,14.61 182.25,14.61 180.97,13.34 E11.2
BMB11
  Top 0.254: 181.61,22.86 181.61,15.24 182.88,13.97 E11.1 | 181.61,22.86 182.88,24.13 E12.1 | 181.61,22.86 181.61,35.56 182.88,36.83 E13.1
  Bottom 0.254: D35L1.TT 207.65,10.16 206.38,8.89 197.49,8.89 196.22,10.16 D35L2.TT 194.94,10.16 193.68,11.43 187.32,11.43 186.06,12.7 183.51,12.7 E11.1
BTS1  (via drill 0.61)
  Top 0.254: E16.13 175.26,80.01 175.26,85.09 E16.4 | v161.29,76.83 161.29,36.83 161.93,36.2 161.93,19.68 160.66,18.41 LASTDEV.3
  Bottom 0.254: LASTDEV.3 158.75,17.78 156.21,15.24 151.76,15.24 D36L1.NN 150.5,15.24 149.22,13.97 141.6,13.97 140.34,15.24 D36L2.NN | v161.29,76.83 173.35,76.83 174.62,78.11 E16.13
BTS3
  Top 0.254: LASTDEV.4 158.75,20.32 151.76,20.32 D36L1.JJ
  Bottom 0.254: D36L2.JJ 140.34,20.32 141.6,19.05 149.22,19.05 150.5,20.32 D36L1.JJ
CLK_BUF  (via drill 0.61)
  Top 0.254: v223.52,56.52 222.25,57.78 222.25,68.58 220.98,69.85 E5.6 | 110.49,30.48 110.49,20.32 111.76,19.05 E21.10 111.76,16.51 113.03,15.24 113.03,1.27 227.97,1.27 238.12,11.43 238.12,47.62 v238.76,48.26 | 110.49,30.48 111.76,31.75 E22.10 | 110.49,30.48 110.49,45.72 111.76,46.99 E23.10
  Bottom 0.254: v223.52,56.52 227.97,56.52 230.5,53.98 E4.2 231.78,52.7 236.22,48.26 v238.76,48.26
DONE  (via drill 0.61)
  Top 0.254: v39.37,76.83 39.37,50.8 38.1,49.53 E36.10 | E32.11 91.44,92.71 91.44,87.63 E31.4 | v149.86,90.81 149.86,92.71 E20.13 | v119.38,89.53 119.38,87.63 E25.3 | v224.79,88.27 224.79,81.28 226.06,80.01 E6.11
  Bottom 0.254: v39.37,76.83 50.8,88.27 89.53,88.27 | 89.53,88.27 90.81,87 E31.4 | 89.53,88.27 117.47,88.27 118.75,87 E25.3 | 147.96,88.9 v149.86,90.81 | 147.96,88.9 120.02,88.9 v119.38,89.53 | v224.79,88.27 224.16,88.9 147.96,88.9
DONE_FF
  Bottom 0.254: E16.10 168.28,79.38 169.54,80.64 183.51,80.64 184.15,80.01 184.15,78.74 195.58,78.74 197.49,80.64 198.75,80.64 200.03,79.38 IC10.6
DONE_SKIP  (via drill 0.61)
  Top 0.254: v111.76,90.81 111.76,92.71 E26.9 | v139.7,90.81 140.97,92.08 | 140.97,92.08 140.97,99.06 142.24,100.33 E20.5 | 140.97,92.08 140.97,66.04 142.24,64.77 E18.10
  Bottom 0.254: v111.76,90.81 112.39,91.44 139.06,91.44 v139.7,90.81
ERR_SKIP  (via drill 0.61)
  Top 0.254: v116.2,106.05 112.39,102.23 E26.6 | v144.78,105.41 144.78,102.87 E20.4 144.78,100.33 143.51,99.06 143.51,73.66 144.78,72.39 E18.4
  Bottom 0.254: v116.2,106.05 119.38,106.05 120.02,105.41 v144.78,105.41
ERROR  (via drill 0.61)
  Top 0.254: v60.96,104.78 49.53,93.34 49.53,58.42 48.26,57.15 E36.1 | v130.18,108.58 132.72,106.05 v132.72,85.09 | v144.78,81.92 144.78,80.01 E19.11
  Bottom 0.254: v60.96,104.78 111.76,104.78 115.57,108.58 v130.18,108.58 | v132.72,85.09 135.89,81.92 v144.78,81.92
GND  (via drill 0.61)
  Top 0.508: D34L1.UU 68.58,8.26 68.58,9.53 D34L1.SS 68.58,10.79 68.58,12.06 D34L1.PP 68.58,13.34 68.58,14.61 D34L1.MM 68.58,15.88 68.58,17.14 D34L1.KK 68.58,18.41 68.58,19.68 D34L1.HH 68.58,20.95 68.58,22.23 D34L1.EE 68.58,23.5 68.58,24.77 D34L1.CC 68.58,26.04 68.58,27.3 D34L1.AA 68.58,28.57 68.58,29.84 D34L1.Y 68.58,31.11 68.58,32.38 D34L1.W 68.58,33.66 68.58,34.92 D34L1.U 68.58,36.2 68.58,37.47 D34L1.S 68.58,38.73 68.58,40.01 D34L1.P 68.58,41.27 68.58,42.55 D34L1.M 68.58,43.81 68.58,45.09 D34L1.K 68.58,46.35 68.58,47.62 D34L1.H 68.58,48.9 68.58,50.16 D34L1.E 68.58,51.44 68.58,52.7 D34L1.C 68.58,53.98 68.58,55.24 D34L1.A | 100.33,73.03 100.33,70.48 101.6,69.22 C30.2 | 100.33,73.03 100.33,83.19 101.6,84.45 C31.2 | E24.7 109.22,72.39 107.95,73.66 107.95,83.82 109.22,85.09 E25.7 109.22,87.63 106.68,90.17 106.68,94.61 101.6,99.69 C32.2 | 82.55,67.31 78.74,63.5 78.74,57.15 IC6.4 | 82.55,67.31 83.82,68.58 E30.7 | 82.55,67.31 82.55,73.03 | 82.55,73.03 82.55,83.82 83.82,85.09 E31.7 | 82.55,73.03 100.33,73.03 | SL1.3 17.14,78.11 17.14,76.83 SL1.2 | 33.02,38.1 33.02,39.37 E35.7 | 33.02,38.1 33.02,36.2 28.57,31.75 28.57,26.67 27.94,26.04 R10.1 | 33.02,38.1 26.04,38.1 R13.1 | R16.1 26.04,12.7 27.3,12.7 R12.1 | DRIVE.MM 10.16,14.61 10.16,13.34 DRIVE.PP 10.16,12.06 10.16,10.79 DRIVE.SS 10.16,9.53 10.16,8.26 DRIVE.UU 10.79,7.62 12.06,7.62 DRIVE.VV 12.7,8.26 12.7,9.53 DRIVE.TT | DRIVE.NN 12.06,15.24 10.79,15.24 DRIVE.MM | DRIVE.MM 10.16,15.88 10.16,17.14 DRIVE.KK 10.16,18.41 10.16,19.68 DRIVE.HH | DRIVE.JJ 12.06,20.32 10.79,20.32 DRIVE.HH | DRIVE.HH 10.16,20.95 10.16,22.23 DRIVE.EE 10.16,23.5 10.16,24.77 DRIVE.CC
  Top 0.508: DRIVE.CC 10.16,26.04 10.16,27.3 DRIVE.AA 10.16,28.57 10.16,29.84 DRIVE.Y | DRIVE.Z 12.06,30.48 10.79,30.48 DRIVE.Y | DRIVE.Y 10.16,31.11 10.16,32.38 DRIVE.W 10.16,33.66 10.16,34.92 DRIVE.U | DRIVE.V 12.06,35.56 10.79,35.56 DRIVE.U | DRIVE.U 10.16,36.2 10.16,37.47 DRIVE.S 10.16,38.73 10.16,40.01 DRIVE.P | DRIVE.P 10.16,41.27 10.16,42.55 DRIVE.M 10.16,43.81 10.16,45.09 DRIVE.K | DRIVE.L 12.06,45.72 10.79,45.72 DRIVE.K | DRIVE.K 10.16,46.35 10.16,47.62 DRIVE.H 10.16,48.9 10.16,50.16 DRIVE.E | DRIVE.F 12.06,50.8 10.79,50.8 DRIVE.E | DRIVE.E 10.16,51.44 10.16,52.7 DRIVE.C 10.16,53.98 10.16,55.24 DRIVE.A 10.79,55.88 12.06,55.88 DRIVE.B 12.7,56.52 12.7,63.5 15.24,66.04 IC8.4 | DRIVE.DD 12.06,25.4 10.79,25.4 DRIVE.CC | DRIVE.R 12.06,40.64 10.79,40.64 DRIVE.P | C33.2 73.66,75.56 72.39,76.83 72.39,98.42 73.66,99.69 C34.2 | D34L2.UU 58.42,8.26 58.42,9.53 D34L2.SS 58.42,10.79 58.42,12.06 D34L2.PP 58.42,13.34 58.42,14.61 D34L2.MM 58.42,15.88 58.42,17.14 D34L2.KK 58.42,18.41 58.42,19.68 D34L2.HH 58.42,20.95 58.42,22.23 D34L2.EE 58.42,23.5 58.42,24.77 D34L2.CC 58.42,26.04 58.42,27.3 D34L2.AA 58.42,28.57 58.42,29.84 D34L2.Y 58.42,31.11 58.42,32.38 D34L2.W 58.42,33.66 58.42,34.92 D34L2.U 58.42,36.2 58.42,37.47 D34L2.S 58.42,38.73 58.42,40.01 D34L2.P 58.42,41.27 58.42,42.55 D34L2.M 58.42,43.81 58.42,45.09 D34L2.K 58.42,46.35 58.42,47.62 D34L2.H 58.42,48.9 58.42,50.16 D34L2.E 58.42,51.44 58.42,52.7 D34L2.C | 59.69,76.2 56.52,76.2 C37.2 55.88,75.56 55.88,73.66 C40.- 55.88,71.12 55.88,64.14 R15.1 55.88,62.87 58.42,60.33 58.42,56.52 D34L2.A 58.42,55.24 58.42,53.98 D34L2.C
  Top 0.508: 59.69,76.2 60.33,76.2 IC9.4 | C36.2 51.44,53.34 57.78,53.34 D34L2.C | 59.69,76.2 59.69,99.06 60.96,100.33 IC7.4 | D36L2.UU 137.16,8.26 137.16,9.53 D36L2.SS 137.16,10.79 137.16,12.06 D36L2.PP 137.16,13.34 137.16,14.61 D36L2.MM 137.16,15.88 137.16,17.14 D36L2.KK 137.16,18.41 137.16,19.68 D36L2.HH 137.16,20.95 137.16,22.23 D36L2.EE 137.16,23.5 137.16,24.77 D36L2.CC 137.16,26.04 137.16,27.3 D36L2.AA 137.16,28.57 137.16,29.84 D36L2.Y 137.16,31.11 137.16,32.38 D36L2.W 137.16,33.66 137.16,34.92 D36L2.U 137.16,36.2 137.16,37.47 D36L2.S 137.16,38.73 137.16,40.01 D36L2.P 137.16,41.27 137.16,42.55 D36L2.M 137.16,43.81 137.16,45.09 D36L2.K 137.16,46.35 137.16,47.62 D36L2.H 137.16,48.9 137.16,50.16 D36L2.E 137.16,51.44 137.16,52.7 D36L2.C 137.16,53.98 137.16,55.24 D36L2.A 137.16,56.52 135.89,57.78 135.89,73.66 | 135.89,73.66 137.16,72.39 E18.7 | 135.89,73.66 135.89,83.82 137.16,85.09 E19.7 137.16,87.63 135.89,88.9 135.89,99.06 137.16,100.33 E20.7 | C18.2 154.94,70.48 154.94,79.38 C19.2 154.94,80.64 156.21,81.92 156.21,98.42 154.94,99.69 C20.2 | 234.95,24.77 234.95,15.88 233.68,14.61 C1.2 | 234.95,24.77 233.68,26.04 C2.2 | 234.95,24.77 234.95,37.47 233.68,38.73 C3.2 233.68,40.01 237.49,43.81 237.49,50.16 | 237.49,50.16 236.22,51.44 C4.2 | 237.49,67.94 236.22,69.22 C5.2 | 237.49,50.16 237.49,67.94 | 237.49,83.19 236.22,84.45 C6.2 | 237.49,67.94 237.49,83.19 | 237.49,83.19 237.49,98.42 236.22,99.69 C7.2 | D35L1.UU 205.74,8.26 205.74,9.53 D35L1.SS 205.74,10.79 205.74,12.06 D35L1.PP 205.74,13.34 205.74,14.61 D35L1.MM 205.74,15.88 205.74,17.14 D35L1.KK 205.74,18.41 205.74,19.68 D35L1.HH 205.74,20.95 205.74,22.23 D35L1.EE 205.74,23.5 205.74,24.77 D35L1.CC 205.74,26.04 205.74,27.3 D35L1.AA 205.74,28.57 205.74,29.84 D35L1.Y 205.74,31.11 205.74,32.38 D35L1.W 205.74,33.66 205.74,34.92 D35L1.U 205.74,36.2 205.74,37.47 D35L1.S 205.74,38.73 205.74,40.01 D35L1.P 205.74,41.27 205.74,42.55 D35L1.M 205.74,43.81 205.74,45.09 D35L1.K 205.74,46.35 205.74,47.62 D35L1.H 205.74,48.9 205.74,50.16 D35L1.E 205.74,51.44 205.74,52.7 D35L1.C 205.74,53.98 205.74,55.24 D35L1.A
  Top 0.508: 219.71,55.24 220.98,55.24 220.98,54.61 E4.6 | 219.71,55.24 217.81,55.24 216.53,53.98 E4.8 | 219.71,55.24 219.71,68.58 218.44,69.85 E5.7 | E16.12 172.72,80.01 173.99,81.28 173.99,91.44 175.26,92.71 E17.13 | C16.2 185.42,85.72 185.42,94.61 C17.2 | C8.2 210.82,70.48 209.55,71.75 209.55,83.19 210.82,84.45 C9.2 | C10.2 210.82,99.69 214,96.52 214,90.81 217.81,87 E6.7 | E14.8 165.1,59.69 163.83,60.96 163.83,69.85 165.1,71.12 E15.7 | D35L2.A 193.04,55.24 193.04,53.98 D35L2.C 193.04,52.7 193.04,51.44 D35L2.E 193.04,50.16 193.04,48.9 D35L2.H 193.04,47.62 193.04,46.35 D35L2.K 193.04,45.09 193.04,43.81 D35L2.M 193.04,42.55 193.04,41.27 D35L2.P 193.04,40.01 193.04,38.73 D35L2.S 193.04,37.47 193.04,36.2 D35L2.U 193.04,34.92 193.04,33.66 D35L2.W 193.04,32.38 193.04,31.11 D35L2.Y 193.04,29.84 193.04,28.57 D35L2.AA 193.04,27.3 193.04,26.04 D35L2.CC 193.04,24.77 193.04,23.5 D35L2.EE 193.04,22.23 193.04,20.95 D35L2.HH 193.04,19.68 193.04,18.41 D35L2.KK 193.04,17.14 193.04,15.88 D35L2.MM 193.04,14.61 193.04,13.34 D35L2.PP 193.04,12.06 193.04,10.79 D35L2.SS 193.04,9.53 193.04,8.26 D35L2.UU | C15.2 182.88,70.48 185.42,67.94 185.42,57.78 C14.2 | D36L1.UU 148.59,8.26 148.59,9.53 D36L1.SS 148.59,10.79 148.59,12.06 D36L1.PP 148.59,13.34 148.59,14.61 D36L1.MM | D36L1.MM 148.59,15.88 148.59,17.14 D36L1.KK 148.59,18.41 148.59,19.68 D36L1.HH 148.59,20.95 148.59,22.23 D36L1.EE 148.59,23.5 148.59,24.77 D36L1.CC 148.59,26.04 148.59,27.3 D36L1.AA 148.59,28.57 148.59,29.84 D36L1.Y 148.59,31.11 148.59,32.38 D36L1.W 148.59,33.66 148.59,34.92 D36L1.U 148.59,36.2 148.59,37.47 D36L1.S 148.59,38.73 148.59,40.01 D36L1.P 148.59,41.27 148.59,42.55 D36L1.M 148.59,43.81 148.59,45.09 D36L1.K 148.59,46.35 148.59,47.62 D36L1.H 148.59,48.9 148.59,50.16 D36L1.E 148.59,51.44 148.59,52.7 D36L1.C 148.59,53.98 148.59,55.24 D36L1.A
  Top 0.508: 163.83,12.7 164.47,12.7 E11.8 | 163.83,12.7 161.29,12.7 LASTDEV.1 159.38,13.34 159.38,13.97 150.5,13.97 149.22,15.24 D36L1.MM | 163.83,12.7 163.83,22.86 165.1,24.13 E12.8 | IC10.4 198.12,85.09 193.04,80.01 193.04,72.39 E8.7 | v110.49,12.7 110.49,19.05 109.86,19.68 109.86,23.5 109.22,24.13 E21.8
  Bottom 0.508: E21.8 108.58,24.77 102.87,24.77 102.23,24.13 C27.2 101.6,23.5 93.34,23.5 92.08,24.77 IC4.4 90.81,26.04 89.53,27.3 80.64,27.3 79.38,26.04 IC3.4 78.11,24.77 77.47,24.13 70.48,24.13 69.22,22.86 D34L1.EE | E22.8 108.58,40.01 102.87,40.01 102.23,39.37 C28.2 100.97,39.37 99.69,38.1 93.98,38.1 92.08,40.01 IC1.4 90.81,41.27 89.53,42.55 80.64,42.55 79.38,41.27 IC2.4 78.11,41.27 77.47,41.91 70.48,41.91 69.22,40.64 D34L1.P | C32.2 102.23,100.33 102.87,100.97 108.58,100.97 E26.7 | C30.2 102.23,68.58 104.14,70.48 108.58,70.48 E24.7 | E23.8 109.22,54.61 102.23,54.61 C29.2 101.6,53.98 93.34,53.98 92.08,55.24 IC5.4 90.81,56.52 89.53,57.78 80.64,57.78 79.38,56.52 IC6.4 78.11,55.24 77.47,54.61 70.48,54.61 69.22,55.88 D34L1.A | 15.24,69.22 15.24,76.2 16.51,76.2 SL1.2 | 15.24,69.22 15.24,68.58 IC8.4 | 15.24,69.22 24.13,69.22 27.3,66.04 C39.2 | 18.41,11.43 17.78,10.79 12.7,10.79 DRIVE.TT | 18.41,11.43 19.68,12.7 R17.1 | 18.41,11.43 23.5,11.43 24.77,12.7 R16.1 | 15.88,39.37 14.61,40.64 13.34,40.64 DRIVE.R | 15.88,39.37 17.14,38.1 R14.1 | R11.1 17.14,25.4 13.34,25.4 DRIVE.DD | 15.88,39.37 23.5,39.37 24.77,38.1 R13.1 | C38.2 51.44,97.79 54.61,100.97 60.33,100.97 IC7.4 61.59,100.97 62.87,99.69 73.66,99.69 C34.2 74.3,100.33 82.55,100.33 83.19,100.97 E32.7 | C35.2 51.44,39.37 52.7,40.64 57.78,40.64 D34L2.P | 39.37,53.34 50.16,53.34 C36.2 | 39.37,53.34 35.56,53.34 33.66,55.24 E36.7 | 39.37,53.34 39.37,46.99 33.66,41.27 E35.7 | D34L1.UU 67.94,7.62 66.67,8.89 60.33,8.89 59.05,10.16 D34L2.SS | C23.2 130.18,54.61 131.44,53.34 136.53,53.34 D36L2.C | C22.2 130.18,39.37 131.44,38.1 136.53,38.1 D36L2.S
  Bottom 0.508: C21.2 130.18,24.13 131.44,25.4 136.53,25.4 D36L2.CC | C24.2 127.64,69.85 128.27,70.48 136.53,70.48 E18.7 | C25.2 127.64,85.09 128.91,86.36 136.53,86.36 E19.7 | C26.2 127.64,100.33 128.27,100.97 136.53,100.97 E20.7 137.79,100.97 139.7,99.06 153.03,99.06 154.31,100.33 C20.2 | C2.2 233.68,26.04 230.5,26.04 229.24,27.3 E2.2 227.97,28.57 226.69,29.84 217.81,29.84 216.53,28.57 E2.7 215.26,28.57 214.63,29.21 207.65,29.21 206.38,27.94 D35L1.AA | E1.7 215.26,14.61 214.63,13.97 207.65,13.97 206.38,12.7 D35L1.PP | E4.8 215.26,52.7 214.63,52.07 207.65,52.07 206.38,53.34 D35L1.C | C16.2 186.06,85.09 196.85,85.09 197.49,85.72 IC10.4 198.75,85.72 200.03,84.45 210.82,84.45 C9.2 211.46,85.09 217.17,85.09 217.81,85.72 E6.7 | 182.88,95.89 185.42,95.89 C17.2 | 182.88,95.89 177.16,95.89 175.9,94.61 E17.13 | E10.7 193.68,100.97 195.58,99.06 208.91,99.06 210.19,100.33 C10.2 | C12.2 186.06,24.13 187.32,25.4 192.41,25.4 D35L2.CC | E8.7 192.41,71.12 183.51,71.12 C15.2 182.88,70.48 182.25,69.85 167.64,69.85 165.74,71.75 E15.7 | 186.06,57.15 187.32,55.88 192.41,55.88 D35L2.A | 186.06,57.15 C14.2 186.06,57.15 | E13.8 165.74,38.73 167,40.01 170.81,40.01 172.09,38.73 E13.5 173.35,37.47 174.62,36.2 185.42,36.2 C13.2 186.06,36.83 187.32,38.1 192.41,38.1 D35L2.S | E12.5 172.09,26.04 170.81,27.3 167,27.3 165.74,26.04 E12.8 | D35L2.SS 192.41,10.16 187.32,10.16 186.06,11.43 C11.2 185.42,10.79 174.62,10.79 | 174.62,10.79 173.35,12.06 E11.5 | 174.62,10.79 167,10.79 165.74,12.06 E11.8 | 186.06,57.15 203.84,57.15 205.1,55.88 D35L1.A | D36L2.E 137.79,50.8 139.06,49.53 141.6,49.53 142.88,48.26 147.96,48.26 D36L1.H
  Bottom 0.508: v110.49,12.7 136.53,12.7 D36L2.PP | 182.88,95.89 182.88,95.25 E17.16
INIT  (via drill 0.61)
  Top 0.254: v147.32,67.94 147.32,64.77 E18.12 147.32,62.23 147.32,3.17 170.81,3.17 171.45,3.81 171.45,6.99 180.97,6.99 181.61,6.35 181.61,3.17 205.74,3.17 209.55,6.99 215.26,6.99 E1.8 | v167.64,67.94 170.18,70.48 170.18,71.12 E15.5 170.81,71.75 172.09,71.75 E15.4 | IC8.7 18.41,59.05 19.68,59.05 IC8.7 | 111.12,97.16 114.3,100.33 E26.5 | 111.12,97.16 109.22,95.25 E26.8 | 97.79,107.95 103.5,107.95 103.5,104.78 111.12,97.16 | 97.79,107.95 59.05,107.95 49.53,98.42 49.53,97.16 46.35,97.16 41.91,92.71 41.91,87.63 38.1,87.63 19.05,68.58 19.05,62.23 17.78,60.96 IC8.7 | v109.86,67.94 104.78,73.03 104.78,85.72 97.79,92.71 97.79,107.95
  Bottom 0.254: v167.64,67.94 v147.32,67.94 114.94,67.94 114.3,68.58 110.49,68.58 v109.86,67.94 | E26.2 121.28,100.97 120.02,99.69 116.2,99.69 114.94,100.97 E26.5
LCD1
  Top 0.254: E31.2 97.16,85.72 98.42,85.72 E31.1
  Bottom 0.254: E25.6 111.12,85.72 109.86,84.45 104.14,84.45 102.23,86.36 99.69,86.36 E31.1
MAINT  (via drill 0.61)
  Top 0.254: E36.6 35.56,54.61 35.56,49.53 E36.9 35.56,46.99 35.56,41.91 E35.6 35.56,39.37 35.56,34.29 E35.9 36.2,33.66 42.55,40.01 E35.3 | v222.25,106.68 222.25,88.9 223.52,87.63 E6.5 | v90.81,106.05 87.63,102.87 87.63,96.52 86.36,95.25 E32.9 86.36,92.71 81.92,88.27 81.92,69.22 v72.39,59.69
  Bottom 0.254: E36.6 36.2,55.24 37.47,53.98 43.81,53.98 45.09,55.24 E36.2 46.35,56.52 49.53,59.69 v72.39,59.69 | v222.25,106.68 216.53,112.39 116.84,112.39 109.86,105.41 91.44,105.41 v90.81,106.05
MSB8  (via drill 0.61)
  Top 0.254: v95.25,20.95 95.25,30.48 93.98,31.75 IC1.6 | v198.12,67.94 198.12,69.85 E8.5 | v125.73,66.67 125.73,60.96 124.46,59.69 124.46,57.15 E23.2 | E21.12 116.84,19.05 115.57,20.32 115.57,34.29 116.2,34.92 117.47,34.92 118.11,34.29 118.11,31.75 118.75,31.11 120.65,31.11 120.65,53.34 121.92,54.61 E23.3
  Bottom 0.254: v95.25,20.95 95.89,20.32 99.06,20.32 99.69,19.68 100.33,19.68 100.97,20.32 114.3,20.32 116.2,18.41 E21.12 | E23.3 122.56,55.24 123.83,55.24 E23.2 | v198.12,67.94 197.49,68.58 169.54,68.58 167.64,66.67 167,66.67 166.37,67.31 147.96,67.31 147.32,66.67 v125.73,66.67
MSB12  (via drill 0.61)
  Top 0.254: v199.39,104.14 199.39,84.45 200.66,84.45 204.47,80.64 204.47,73.66 205.74,72.39 E8.2 | v139.06,107.31 133.99,102.23 v133.99,64.14 | v125.73,59.69 125.73,54.61 125.09,53.98 123.19,53.98 123.19,57.15 122.56,57.78 118.11,57.78 118.11,50.8 116.84,49.53 E23.12
  Bottom 0.254: IC6.1 87,55.24 89.53,52.7 112.39,52.7 116.2,48.9 E23.12 | v199.39,104.14 197.49,106.05 178.44,106.05 177.8,105.41 154.31,105.41 152.4,107.31 v139.06,107.31 | v133.99,64.14 129.54,59.69 v125.73,59.69
N$1
  Top 0.254: E14.9 165.1,49.53 165.1,46.35 76.1
N$2
  Bottom 0.254: IC1.1 99.69,41.27 104.14,45.72 119.38,45.72 121.28,47.62 E23.14
N$3  (via drill 0.61)
  Top 0.254: 83.19,10.16 83.19,17.14 IC3.7 83.82,19.05 83.82,24.13 IC3.2 83.82,26.67 82.55,27.94 82.55,38.1 83.82,39.37 IC2.2 | 83.19,10.16 83.19,6.35 57.78,6.35 48.26,15.88 48.26,29.21 45.72,31.75 E35.13 | v121.92,66.04 121.92,69.85 E24.2 | v99.06,66.04 97.79,64.77 97.79,58.42 96.52,57.15 IC5.2 96.52,54.61 96.52,49.53 IC5.7 96.52,46.99 95.25,45.72 95.25,35.56 96.52,34.29 IC1.7 96.52,31.75 96.52,26.67 IC4.2 96.52,24.13 96.52,19.05 IC4.7 95.89,17.14 95.89,10.16 83.19,10.16
  Bottom 0.254: v99.06,66.04 v121.92,66.04
N$4  (via drill 0.61)
  Top 0.254: v63.5,39.37 67.31,43.18 67.31,64.77 72.39,69.85 72.39,71.75 81.28,80.64 81.28,90.17 83.82,92.71 E32.8
  Bottom 0.254: v63.5,39.37 57.78,39.37 56.52,38.1 45.72,38.1 41.27,33.66 E35.11
N$5
  Top 0.254: E14.15 180.34,49.53 180.34,46.35 70.1
N$6
  Top 0.254: E14.14 177.8,49.53 177.8,46.35 71.1
N$7
  Top 0.254: E14.13 175.26,49.53 175.26,46.35 72.1
N$8
  Top 0.254: E14.12 172.72,49.53 172.72,46.35 73.1
N$9
  Top 0.254: E14.11 170.18,49.53 170.18,46.35 74.1
N$10
  Top 0.254: E14.10 167.64,49.53 167.64,46.35 75.1
N$11
  Bottom 0.254: E14.7 167.64,57.15 167.64,52.7 164.47,52.7 162.56,50.8 162.56,46.35 77.1
N$12  (via drill 0.61)
  Top 0.254: IC2.7 83.82,34.29 85.09,35.56 85.09,43.18 v84.45,43.81 83.82,44.45 83.82,46.99 IC6.7 83.82,49.53 83.82,54.61 IC6.2 | v107.31,69.22 105.41,67.31 105.41,44.45 103.5,42.55 96.52,42.55 96.52,41.91 IC1.2
  Bottom 0.254: v84.45,43.81 93.34,43.81 95.89,41.27 IC1.2 | v107.31,69.22 117.47,69.22 118.75,70.48 E24.3
N$13
  Top 0.254: E38.1 48.26,100.33 48.26,100.97 PAD10.1
N$14
  Top 0.254: E38.2 45.72,100.33 45.72,100.97 PAD11.1
N$15
  Top 0.254: E38.3 43.18,100.33 43.18,100.97 PAD12.1
N$16
  Top 0.254: E38.4 40.64,100.33 40.64,100.97 PAD13.1
N$17
  Top 0.254: E38.5 38.1,100.33 38.1,100.97 PAD14.1
N$18
  Top 0.254: E38.6 35.56,100.33 35.56,100.97 PAD15.1
N$19
  Top 0.254: E38.7 33.02,100.33 33.02,100.97 PAD16.1
N$20
  Top 0.254: E38.8 30.48,100.33 30.48,100.97 PAD17.1
N$21  (via drill 0.61)
  Top 0.254: v227.33,55.24 227.33,68.58 228.6,69.85 E5.3
  Bottom 0.254: v227.33,55.24 225.43,55.24 224.16,53.98 E4.5
N$22  (via drill 0.61)
  Top 0.254: v114.3,67.31 114.3,64.77 E24.10 | v146.05,65.41 146.05,91.44 144.78,92.71 E20.11
  Bottom 0.254: v114.3,67.31 123.83,67.31 125.73,65.41 126.36,66.04 146.05,66.04 | 146.05,66.04 163.83,66.04 164.47,66.67 165.74,66.67 167,65.41 E15.9 | 146.05,66.04 v146.05,65.41
N$23
  Top 0.254: E38.16 48.26,90.17 48.26,89.53 PAD20.1
N$24
  Top 0.254: E38.15 45.72,90.17 45.72,89.53 PAD21.1
N$25
  Top 0.254: E38.14 43.18,90.17 43.18,89.53 PAD22.1
N$26
  Top 0.254: E38.13 40.64,90.17 40.64,89.53 PAD23.1
N$27
  Top 0.254: E38.12 38.1,90.17 38.1,89.53 PAD24.1
N$28
  Top 0.254: E38.11 35.56,90.17 35.56,89.53 PAD25.1
N$29
  Top 0.254: E38.10 33.02,90.17 33.02,89.53 PAD26.1
N$30
  Top 0.254: E38.9 30.48,90.17 30.48,89.53 PAD27.1
N$31  (via drill 0.61)
  Top 0.254: E21.2 123.83,24.77 122.56,24.77 E21.3 121.92,26.67 116.84,31.75 E22.12 | v92.71,31.11 92.71,20.32 93.98,19.05 IC4.6
  Bottom 0.254: v92.71,31.11 114.94,31.11 116.2,32.38 E22.12
N$32  (via drill 0.61)
  Top 0.254: v121.92,59.05 121.92,59.69 119.38,62.23 E24.12
  Bottom 0.254: v121.92,59.05 122.56,58.42 137.16,58.42 140.34,61.59 161.93,61.59 164.47,64.14 E15.8
N$33
  Bottom 0.254: IC6.6 81.92,47.62 83.19,46.35 117.47,46.35 118.75,47.62 E23.13
N$34
  Top 0.254: E40.1 25.4,100.33 25.4,100.97 PAD18.1
N$35
  Bottom 0.254: E5.11 226.69,64.14 233.04,70.48 E5.1
N$36
  Top 0.254: E1.10 220.34,6.99 219.07,6.99 E1.9 218.44,8.89 218.44,13.97 E1.6
  Bottom 0.254: E2.1 231.78,27.94 234.31,27.94 234.95,27.3 234.95,17.14 230.5,17.14 229.87,16.51 229.87,13.34 220.34,13.34 219.07,14.61 E1.6
N$37  (via drill 0.61)
  Top 0.254: E8.13 205.74,64.77 203.2,67.31 203.2,69.85 E8.3 | v175.26,67.31 175.26,71.12 E15.3
  Bottom 0.254: v175.26,67.31 197.49,67.31 199.39,65.41 203.84,65.41 205.1,64.14 E8.13
N$38
  Bottom 0.254: E8.11 201.29,62.87 202.56,62.87 E8.12
N$39
  Top 0.254: E8.9 195.58,64.77 195.58,69.85 E8.6
N$40
  Bottom 0.254: E8.10 197.49,62.87 196.22,61.59 173.99,61.59 172.72,62.87 172.72,63.5 E15.11
N$41
  Top 0.254: E40.2 22.86,100.33 22.86,100.97 PAD19.1
N$42  (via drill 0.61)
  Top 0.254: v189.23,90.17 189.23,68.58 193.04,64.77 E8.8
  Bottom 0.254: IC7.7 66.67,93.34 67.94,92.08 163.19,92.08 164.47,93.34 E17.9 165.74,94.61 167,95.89 170.81,95.89 172.09,94.61 E17.12 173.35,93.34 174.62,92.08 187.32,92.08 v189.23,90.17
N$43
  Top 0.254: E40.3 20.32,100.33 20.32,100.97 PAD28.1
N$44
  Top 0.254: E24.6 111.76,72.39 110.49,73.66 110.49,90.17 107.31,93.34 107.31,96.52 102.23,101.6 99.69,101.6 E32.1
N$45
  Top 0.254: E1.11 223.52,8.89 219.71,12.7 219.71,25.4 218.44,26.67 E2.6
N$46
  Top 0.254: E18.13 150.5,62.87 151.76,61.59 158.75,61.59 158.75,93.98 165.1,100.33 E17.8
N$47
  Top 0.254: E25.10 114.3,80.01 115.57,81.28 115.57,91.44 116.84,92.71 E26.11 117.47,93.34 118.75,93.34 E26.12
N$48
  Top 0.254: E4.10 218.44,46.99 218.44,52.07 E4.7 | E4.3 227.97,52.7 226.69,52.7 E4.4 226.06,54.61 226.06,57.78 R19.2
  Bottom 0.254: E4.7 218.44,54.61 218.44,58.42 225.43,58.42 R19.2
N$49  (via drill 0.61)
  Top 0.254: E14.5 173.35,57.78 174.62,57.78 E14.4 | v191.77,5.71 189.87,7.62 v189.87,43.18
  Bottom 0.254: v191.77,5.71 224.16,5.71 225.43,6.99 E1.12 | v189.87,43.18 188.59,44.45 177.16,44.45 176.53,45.09 176.53,57.15 175.26,57.15 E14.4
N$50
  Top 0.254: E40.4 17.78,100.33 17.78,100.97 PAD29.1
N$51
  Top 0.254: E40.5 15.24,100.33 15.24,100.97 PAD30.1
N$52
  Top 0.254: E40.6 12.7,100.33 12.7,100.97 PAD31.1
N$53
  Top 0.254: E40.7 10.16,100.33 10.16,100.97 PAD32.1
N$54
  Top 0.254: E40.8 7.62,100.33 7.62,100.97 PAD33.1
N$55
  Top 0.254: E40.16 25.4,90.17 25.4,89.53 PAD34.1
N$56
  Top 0.254: E40.15 22.86,90.17 22.86,89.53 PAD35.1
N$57
  Top 0.254: E40.14 20.32,90.17 20.32,89.53 PAD36.1
N$58
  Top 0.254: E40.13 17.78,90.17 17.78,89.53 PAD37.1
N$59
  Top 0.254: E40.12 15.24,90.17 15.24,89.53 PAD38.1
N$60  (via drill 0.61)
  Top 0.254: v81.28,29.84 81.28,31.75 IC2.6 | v121.28,29.84 123.19,31.75 123.19,45.72 124.46,46.99 E23.15
  Bottom 0.254: v81.28,29.84 v121.28,29.84
N$61
  Top 0.254: E40.11 12.7,90.17 12.7,89.53 PAD39.1
N$62  (via drill 0.61)